# EasyEDA Pro project ProDoc_USB-C Advanced Power Supply.epro

# Schematic Schematic
Board Name: USB-C Advanced Power Supply; Create Date: 2026-04-28; Page Name: USB-C Advanced Power Supply; Project Name: USB-C Advanced Power Supply; Schematic Name: Schematic; Update Date: 2026-04-30; Company: FEDEVEL; Drawn: Robert Feranec; Page Size: A3; Version: V1I0
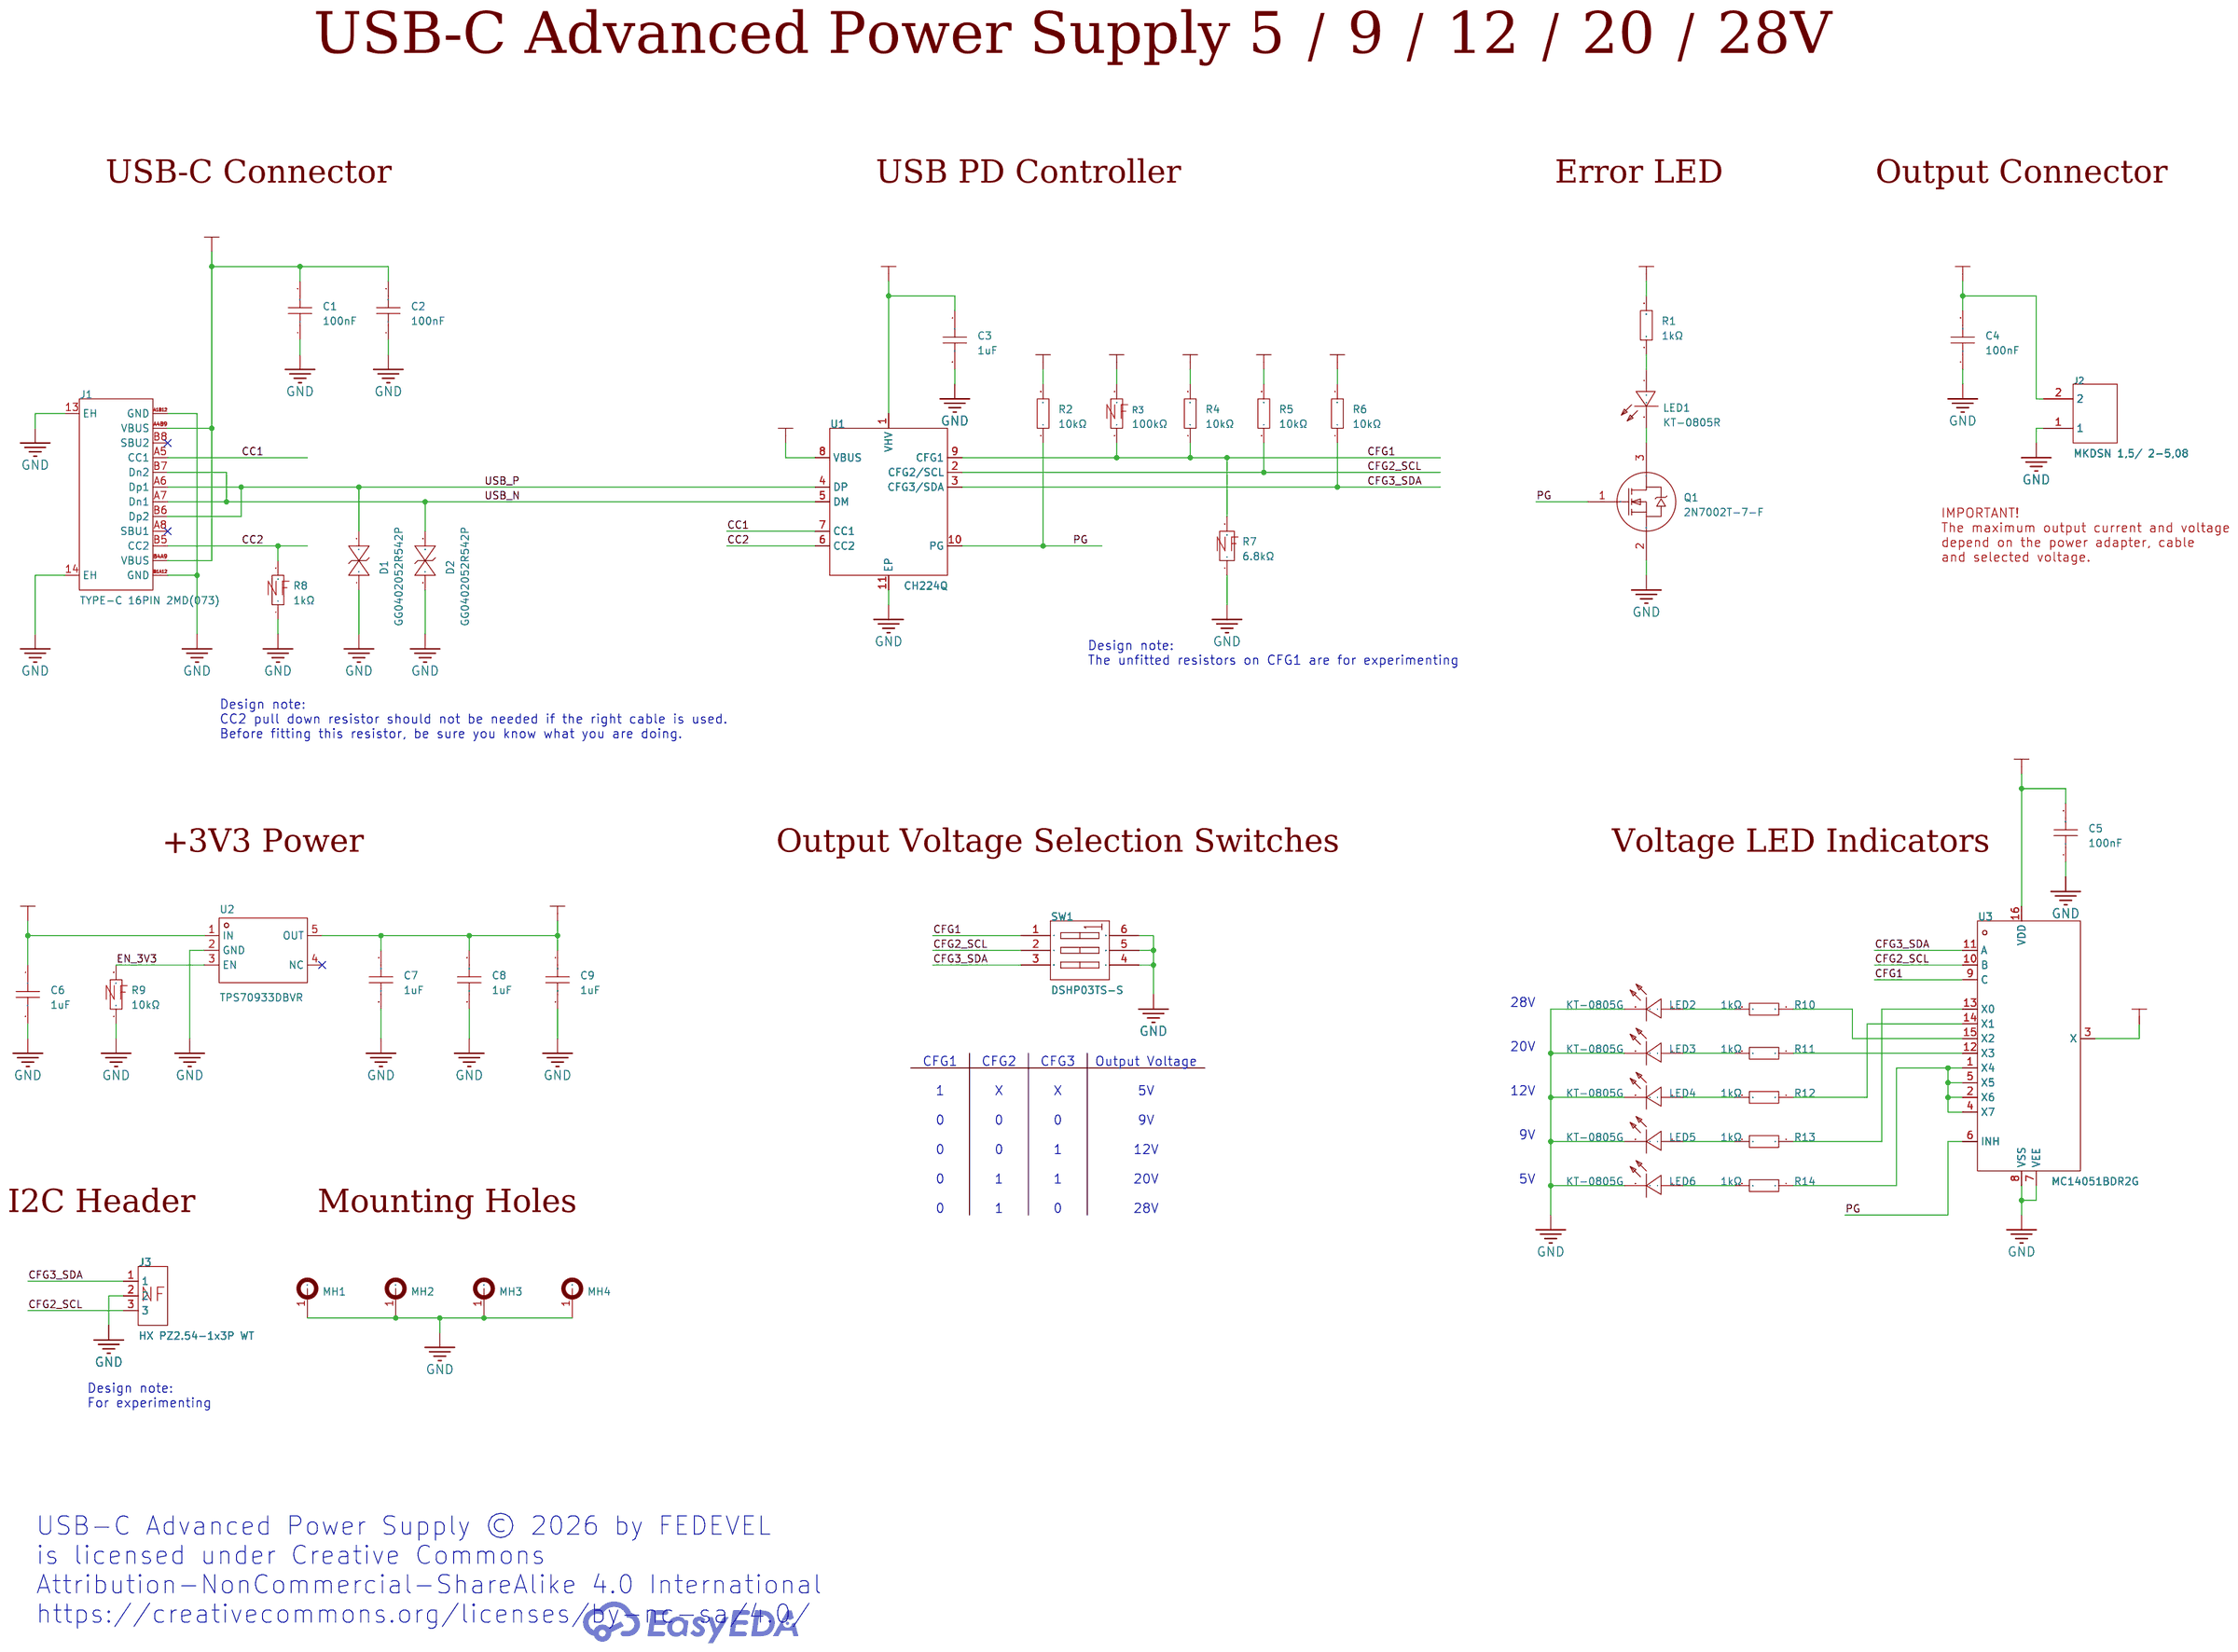
[diagram p0: schematic sheet]

## Parts
C1  100nF  [C0402]
C2  100nF  [C0402]
C3  1uF  [C0603]
C4  100nF  [C0402]
C5  100nF  [C0402]
C6  1uF  [C0603]
C7  1uF  [C0603]
C8  1uF  [C0603]
C9  1uF  [C0603]
D1  GG0402052R542P  [D0402-BI]
D2  GG0402052R542P  [D0402-BI]
J1  TYPE-C 16PIN 2MD(073)  [USB-C-SMD_TYPE-C-16PIN-2MD-073]
J2  MKDSN 1,5/ 2-5,08  [CONN-TH_2P-P5.08_1729128]
J3  HX PZ2.54-1x3P WT  [HDR-SMD_3P-P2.54-H-M_KH-2.54PH-1X3P-L13.5-WT]  (no BOM)
LED1  KT-0805R  [LED0805-R-RD]
LED2  KT-0805G  [LED0805-R-RD]
LED3  KT-0805G  [LED0805-R-RD]
LED4  KT-0805G  [LED0805-R-RD]
LED5  KT-0805G  [LED0805-R-RD]
LED6  KT-0805G  [LED0805-R-RD]
MH1  -  [MH_7.5MMx2.7MM]  (no BOM)
MH2  -  [MH_7.5MMx2.7MM]  (no BOM)
MH3  -  [MH_7.5MMx2.7MM]  (no BOM)
MH4  -  [MH_7.5MMx2.7MM]  (no BOM)
Q1  2N7002T-7-F  [SOT-523-3_L1.6-W0.8-P1.00-LS1.6-BR]
R1  1kΩ  [R0402]
R2  10kΩ  [R0402]
R3  100kΩ  [R0402]  (no BOM)
R4  10kΩ  [R0402]
R5  10kΩ  [R0402]
R6  10kΩ  [R0402]
R7  6.8kΩ  [R0402]  (no BOM)
R8  1kΩ  [R0402]  (no BOM)
R9  10kΩ  [R0402]  (no BOM)
R10  1kΩ  [R0402]
R11  1kΩ  [R0402]
R12  1kΩ  [R0402]
R13  1kΩ  [R0402]
R14  1kΩ  [R0402]
SW1  DSHP03TS-S  [SW-SMD_DSHP03TS-S]
U1  CH224Q  [DFN-10_L2.0-W2.0-P0.40-BL-EP]
U2  TPS70933DBVR  [SOT-23-5_L3.0-W1.7-P0.95-LS2.8-BR]
U3  MC14051BDR2G  [SOIC-16_L9.9-W3.9-P1.27-LS6.0-BL_1]

## Library data of the parts
C1 C2 C4 C5 = CL05B104KB54PNC: Capacitance:100nF Tolerance:±10% Tolerance:±10% Voltage Rating:50V Temperature Coefficient:X7R; LCSC Part Name: 100nF ±10% 50V; Supplier Part: C307331; Manufacturer: SAMSUNG(三星); Supplier Footprint: 0402; JLCPCB Part Class: Basic Part; Datasheet: https://item.szlcsc.com/datasheet/CL05B104KB54PNC/291005.html; Supplier: LCSC; Tolerance: ±10%; Voltage Rating: 50V; Temperature Coefficient: X7R
C3 C6-C9 = CL10B105KB8NQNC: Capacitance:1uF Tolerance:±10% Tolerance:±10% Voltage Rating:50V Temperature Coefficient:X7R; LCSC Part Name: 1uF ±10% 50V; Supplier Part: C5199872; Manufacturer: SAMSUNG(三星); Supplier Footprint: 0603; JLCPCB Part Class: Extended Part; Datasheet: https://item.szlcsc.com/datasheet/CL10B105KB8NQNC/5885909.html; Supplier: LCSC; Tolerance: ±10%; Voltage Rating: 50V; Temperature Coefficient: X7R
D1 D2 = GG0402052R542P: Reverse Stand-Off Voltage (Vrwm):5V Clamping Voltage:15.5V Peak Pulse Current (Ipp):3A@8/20us Peak Pulse Power Dissipation (Ppp):46W@8/20us Voltage - Breakdown:5.5V Reverse Leakage Current (Ir):100nA Operating Temperature:-55℃~+125℃ Operating Temperature:; LCSC Part Name: ESD 5V截止 峰值脉冲电流：3A@8/20us; Supplier Part: C1973257; Manufacturer: Kyocera AVX; Supplier Footprint: 0402; JLCPCB Part Class: Extended Part; Supplier: LCSC; Reverse Stand-Off Voltage (Vrwm): 5V; Clamping Voltage: 15.5V; Peak Pulse Current (Ipp): 3A@8/20us; Peak Pulse Power Dissipation (Ppp): 46W@8/20us; Voltage - Breakdown: 5.5V; Reverse Leakage Current (Ir): 100nA; Operating Temperature: -55℃~+125℃; level of protection: IEC 61000-4-4；IEC 61000-4-2; Type: ESD; Junction Capacitance: 2.5pF
J1 = TYPE-C 16PIN 2MD(073): Connector Type:Type-C Protocol Standard:- Gender:Female Mounting Type:Surface Mount, Right Angle Number of Contacts:16P Number of Ports:1 Current Rating-Power:3A Voltage Rating:5V Connect-Disconnect Life:10,000 Cycles Supplementary Features:- Center Heigh; LCSC Part Name: Type-C 母 卧贴; Supplier Part: C2765186; Manufacturer: SHOU HAN(首韩); Supplier Footprint: SMD; JLCPCB Part Class: Extended Part; Datasheet: https://item.szlcsc.com/datasheet/TYPE-C%252016PIN%25202MD(073)/2901843.html; Supplier: LCSC; Connector Type: Type-C; Gender: Female; Mounting Type: Surface Mount, Right Angle; Number of Contacts: 16P; Number of Ports: 1; Current Rating-Power: 3A; Voltage Rating: 5V; Connect-Disconnect Life: 10,000 Cycles; Detection color: Black; Operating Temperature: -25℃~+85℃
J2 = MKDSN 1,5/ 2-5,08: Connector Type:Board Side/Plug Number of Positions or Pins:1x2P Pitch:5.08mm Color:Green Mounting Type:Through Hole Number of Pins:2P Number of Rows:1 Number of PINs Per Row:2 Current Rating:13.5A Voltage Rating (Max):400V; LCSC Part Name: 1x2P 5.08mm 排数:1 每排P数:2; Supplier Part: C5183989; Manufacturer: Phoenix Contact(菲尼克斯); Supplier Footprint: 插件,P=5.08mm; JLCPCB Part Class: Extended Part; Datasheet: https://item.szlcsc.com/datasheet/MKDSN%25201%252C5%252F%25202-5%252C08/5848939.html; Supplier: LCSC; Connector Type: Board Side/Plug; Number of Positions or Pins: 1x2P; Pitch: 5.08mm; Color: Green; Mounting Type: Through Hole; Number of Pins: 2P; Number of Rows: 1; Number of PINs Per Row: 2; Current Rating: 13.5A; Voltage Rating (Max): 400V
J3 = HX PZ2.54-1x3P WT: Pin Structure:1x3P Pitch:2.54mm Row Spacing:- Circluar Pins/Square Pins:Pin Header Mounting Type:Surface Mount, Right Angle Number of Rows:1 Number of Pins:3P Current Rating:3A Voltage Rating (Max):1kV Length of Mating Pin:6mm Insulation Height:2.5mm Leng; LCSC Part Name: 配套排母：HX PM2.54-1x3P系列 1x3P 间距:2.54mm 方针 卧贴; Supplier Part: C46061676; Manufacturer: hanxia(韩下); Supplier Footprint: SMD,P=2.54mm,卧贴; JLCPCB Part Class: Extended Part; Datasheet: https://item.szlcsc.com/datasheet/HX%2520PZ2.54-1x3P%2520WT/48170536.html; Supplier: LCSC; Pin Structure: 1x3P; Pitch: 2.54mm; Circluar Pins/Square Pins: Pin Header; Mounting Type: Surface Mount, Right Angle; Number of Rows: 1; Number of Pins: 3P; Current Rating: 3A; Voltage Rating (Max): 1kV; Length of Mating Pin: 6mm; Insulation Height: 2.5mm; Contact Material: Brass; Contact Plating: Gold; Operating Temperature: -40℃~+105℃; Color: Black
LED1 = KT-0805R: LCSC Part Name: 0805 红灯 高亮; Supplier Part: C2295; Manufacturer: KENTO; Supplier Footprint: 0805; JLCPCB Part Class: Extended Part; Supplier: LCSC
LED2-LED6 = KT-0805G: Lamp Holder Type:- Illumination Color:Emerald Green Voltage - Forward(Vf):2.6V~3.1V Voltage - Forward(Vf):2.6V~3.1V Power(Watts):100mW Forward Current:5mA Wavelength - Dominant:513nm~528nm Wavelength - Dominant:513nm~528nm Peak Wavelength:525nm Diode Conf; LCSC Part Name: 0805 翠绿 高亮; Supplier Part: C2297; Manufacturer: KENTO; Supplier Footprint: 0805; JLCPCB Part Class: Basic Part; Datasheet: https://item.szlcsc.com/datasheet/KT-0805G/2670.html; Supplier: LCSC; Illumination Color: Emerald Green; Voltage - Forward(Vf): 2.6V~3.1V; Power(Watts): 100mW; Forward Current: 5mA; Wavelength - Dominant: 513nm~528nm; Peak Wavelength: 525nm; Diode Configuration: Discrete Diode; Lens Color: Water Clear; Luminous Intensity: 430mcd; Viewing Angle: 120°; Operating Temperature: -40℃~+85℃
MH1-MH4 = MH_7.5MMx2.7MM
Q1 = 2N7002T-7-F: Number:1 N-Channel Drain to Source Voltage:60V Current - Continuous Drain(Id):115mA RDS(on):13.5Ω@10V,0.5A Pd - Power Dissipation:150mW Gate Threshold Voltage (Vgs(th)):2V@250uA Gate Charge(Qg):- Input Capacitance(Ciss):50pF Reverse Transfer Capacitance (; LCSC Part Name: 1个N沟道 耐压:60V 电流:115mA; Supplier Part: C139445; Manufacturer: DIODES(美台); Supplier Footprint: SOT-523; JLCPCB Part Class: Extended Part; Datasheet: https://item.szlcsc.com/datasheet/2N7002T-7-F/150768.html; Supplier: LCSC; Number: 1 N-Channel; Drain to Source Voltage: 60V; Current - Continuous Drain(Id): 115mA; RDS(on): 13.5Ω@10V,0.5A; Pd - Power Dissipation: 150mW; Gate Threshold Voltage (Vgs(th)): 2V@250uA; Input Capacitance(Ciss): 50pF; Reverse Transfer Capacitance (Crss@Vds): 5pF; Operating Temperature: -55℃~+150℃; Output Capacitance(Coss): 25pF
R1 R8 R10-R14 = 0402WGF1001TCE: Type:Thick Film Resistor Resistance:1kΩ Tolerance:±1% Tolerance:±1% Power(Watts):62.5mW Voltage-Supply(Max):50V Temperature Coefficient:±100ppm/℃ Temperature Coefficient:±100ppm/℃ Operating Temperature:-55℃~+155℃ Operating Temperature:-55℃~+155℃; LCSC Part Name: 1kΩ ±1% 62.5mW 厚膜电阻; Supplier Part: C11702; Manufacturer: UNI-ROYAL(厚声); Supplier Footprint: 0402; JLCPCB Part Class: Basic Part; Datasheet: https://item.szlcsc.com/datasheet/0402WGF1001TCE/12256.html; Supplier: LCSC; Type: Thick Film Resistor; Tolerance: ±1%; Power(Watts): 62.5mW; Voltage-Supply(Max): 50V; Temperature Coefficient: ±100ppm/℃; Operating Temperature: -55℃~+155℃
R2 R4-R6 R9 = 0402WGF1002TCE: Type:Thick Film Resistor Resistance:10kΩ Tolerance:±1% Tolerance:±1% Power(Watts):62.5mW Voltage-Supply(Max):50V Temperature Coefficient:±100ppm/℃ Temperature Coefficient:±100ppm/℃ Operating Temperature:-55℃~+155℃ Operating Temperature:-55℃~+155℃; LCSC Part Name: 10kΩ ±1% 62.5mW 厚膜电阻; Supplier Part: C25744; Manufacturer: UNI-ROYAL(厚声); Supplier Footprint: 0402; JLCPCB Part Class: Basic Part; Datasheet: https://item.szlcsc.com/datasheet/0402WGF1002TCE/26487.html; Supplier: LCSC; Type: Thick Film Resistor; Tolerance: ±1%; Power(Watts): 62.5mW; Voltage-Supply(Max): 50V; Temperature Coefficient: ±100ppm/℃; Operating Temperature: -55℃~+155℃
R3 = 0402WGF1003TCE: Type:Thick Film Resistor Resistance:100kΩ Tolerance:±1% Tolerance:±1% Power(Watts):62.5mW Voltage-Supply(Max):50V Temperature Coefficient:±100ppm/℃ Temperature Coefficient:±100ppm/℃ Operating Temperature:-55℃~+155℃ Operating Temperature:-55℃~+155℃; LCSC Part Name: 100kΩ ±1% 62.5mW 厚膜电阻; Supplier Part: C25741; Manufacturer: UNI-ROYAL(厚声); Supplier Footprint: 0402; JLCPCB Part Class: Basic Part; Datasheet: https://item.szlcsc.com/datasheet/0402WGF1003TCE/26484.html; Supplier: LCSC; Type: Thick Film Resistor; Tolerance: ±1%; Power(Watts): 62.5mW; Voltage-Supply(Max): 50V; Temperature Coefficient: ±100ppm/℃; Operating Temperature: -55℃~+155℃
R7 = NQ02WGF6801TCE: Type:Thick Film Resistor Resistance:6.8kΩ Tolerance:±1% Tolerance:±1% Power(Watts):62.5mW Voltage-Supply(Max):100V Temperature Coefficient:±100ppm/℃ Temperature Coefficient:±100ppm/℃ Operating Temperature:-55℃~+155℃ Operating Temperature:-55℃~+155℃; LCSC Part Name: 厚膜电阻 6.8kΩ ±1% 62.5mW 抗硫化汽车级晶片电阻器; Supplier Part: C965237; Manufacturer: UNI-ROYAL(厚声); Supplier Footprint: 0402; JLCPCB Part Class: Extended Part; Datasheet: https://item.szlcsc.com/datasheet/NQ02WGF6801TCE/1050369.html; Supplier: LCSC; Type: Thick Film Resistor; Tolerance: ±1%; Power(Watts): 62.5mW; Voltage-Supply(Max): 100V; Temperature Coefficient: ±100ppm/℃; Operating Temperature: -55℃~+155℃
SW1 = DSHP03TS-S: Type:Slide, Recessed Circuit:SPST Number of Positions:3 Termination Style:Gull Wing Lead Pitch:1.27mm Current Rating:25mA Voltage Rating:24V Operating Temperature:-20℃~+70℃ Operating Temperature:-20℃~+70℃ Operating Life:3,000 Cycles Color:Black; LCSC Part Name: 间距1.27mm 平拨,凹槽式 3位拨码开关; Supplier Part: C319051; Manufacturer: XKB Connection(中国星坤); Supplier Footprint: SMD-6P,5.4x5.4mm; JLCPCB Part Class: Extended Part; Datasheet: https://item.szlcsc.com/datasheet/DSHP03TS-S/300143.html; Supplier: LCSC; Type: Slide, Recessed; Circuit: SPST; Number of Positions: 3; Termination Style: Gull Wing; Lead Pitch: 1.27mm; Current Rating: 25mA; Voltage Rating: 24V; Operating Temperature: -20℃~+70℃; Operating Life: 3,000 Cycles; Color: Black
U1 = CH224Q-RF: Type:Power Receiver Controller Protocol:PD 3.2；SPR；PPS；AVS；BC 1.2 Number of Channels:1C Output Power:140W Output Voltage:5V；20V；15V；12V；28V；9V Voltage - Supply:4V~30V Voltage - Supply:4V~30V Operating Temperature:-40℃~+105℃ Operating Temperature:-40℃~+105; LCSC Part Name: USBPD多快充协议受电芯片; Supplier Part: C46061833; Manufacturer: WCH(南京沁恒); Supplier Footprint: DFN-10-EP(2x2); Datasheet: https://item.szlcsc.com/datasheet/CH224Q/48170822.html; Supplier: LCSC; Type: Power Receiver Controller; Protocol: PD 3.2；SPR；PPS；AVS；BC 1.2; Number of Channels: 1C; Output Power: 140W; Output Voltage: 5V；20V；15V；12V；28V；9V; Voltage - Supply: 4V~30V; Operating Temperature: -40℃~+105℃
U2 = TPS70933DBVR: Output Type:Fixed Voltage - Supply:30V Output Voltage:3.3V Output Voltage:3.3V Output Current:150mA Power Supply Rejection Ratio (PSRR):80dB@(10Hz) Voltage Dropout:960mV@(150mA) standby current:1.4uA Noise:190uVrms Features:Under Voltage Lockout；Over Curr; LCSC Part Name: 具有反向电流保护和使能功能的 150mA、30V、超低 IQ、低压降稳压器; Supplier Part: C89347; Manufacturer: TI(德州仪器); Supplier Footprint: SOT-23-5; JLCPCB Part Class: Extended Part; Datasheet: https://www.ti.com/cn/lit/gpn/tps709; Supplier: LCSC; Output Type: Fixed; Voltage - Supply: 30V; Output Voltage: 3.3V; Output Current: 150mA; Power Supply Rejection Ratio (PSRR): 80dB@(10Hz); Voltage Dropout: 960mV@(150mA); standby current: 1.4uA; Noise: 190uVrms; Features: Under Voltage Lockout；Over Current Protection；Enable；Over Temperature Protection; Operating Temperature: -40℃~+125℃@(Tj); Output Configuration: Positive; Number of Outputs: 1
U3 = MC14051BDR2G-RF: Switch Circuit:SP8T single pole eight throw Number of Channels:8 Supply Voltage:3V~18V Supply Voltage:3V~18V On-State Resistance (Max):1200Ω Operating Temperature:-55℃~+125℃ Operating Temperature:-55℃~+125℃; LCSC Part Name: MC14051B 8通道模拟多路复用器/多路分路器; Supplier Part: C7284; Manufacturer: onsemi(安森美); Supplier Footprint: SOIC-16; Datasheet: https://atta.szlcsc.com/upload/public/pdf/source/20191223/C463178_08A95CAC7B1F563D85784D081BFDA614.pdf; Supplier: LCSC; Switch Circuit: SP8T single pole eight throw; Number of Channels: 8; Supply Voltage: 3V~18V; On-State Resistance (Max): 1200Ω; Operating Temperature: -55℃~+125℃

## Nets
+3V3: C5.2 C7.1 C8.1 C9.1 R1.2 R2.2 R4.2 R5.2 R6.2 U2.5(OUT) U3.3(X) U3.16(VDD)
GND: C1.1 C2.1 C3.2 C4.1 C5.1 C6.2 C7.2 C8.2 C9.2 D1.1 D2.1 J1.13(EH) J1.14(EH) J1.A1B12(GND) J1.B1A12(GND) J2.1 J3.2 LED2.2(K) LED3.2(K) LED4.2(K) LED5.2(K) LED6.2(K) MH1.1 MH2.1 MH3.1 MH4.1 Q1.2(S) R7.1 R8.1 R9.1 SW1.4 SW1.5 SW1.6 U1.11(EP) U2.2(GND) U3.7(VEE) U3.8(VSS)
+V_USB: C1.2 C2.2 C3.1 C4.2 C6.1 J1.A4B9(VBUS) J1.B4A9(VBUS) J2.2 R3.2 U1.1(VHV) U1.8(VBUS) U2.1(IN)
CC1: J1.A5(CC1) U1.7(CC1)
CC2: J1.B5(CC2) R8.2 U1.6(CC2)
CFG1: R3.1 R4.1 R7.2 SW1.1 U1.9(CFG1) U3.9(C)
CFG2_SCL: J3.3 R5.1 SW1.2 U1.2(CFG2/SCL) U3.10(B)
CFG3_SDA: J3.1 R6.1 SW1.3 U1.3(CFG3/SDA) U3.11(A)
EN_3V3: R9.2 U2.3(EN)
PG: Q1.1(G) R2.1 U1.10(PG) U3.6(INH)
USB_N: D2.2 J1.A7(Dn1) J1.B7(Dn2) U1.5(DM)
USB_P: D1.2 J1.A6(Dp1) J1.B6(Dp2) U1.4(DP)
$1N2677: LED1.1(A) R1.1
$1N2754: LED1.2(K) Q1.3(D)
$1N3526: LED2.1(A) R10.2
$1N3530: LED3.1(A) R11.2
$1N3535: LED4.1(A) R12.2
$1N3540: LED5.1(A) R13.2
$1N3545: LED6.1(A) R14.2
$1N4003: R10.1 U3.15(X2)
$1N4009: R11.1 U3.12(X3)
$1N4014: R12.1 U3.14(X1)
$1N4021: R13.1 U3.13(X0)
$1N4028: R14.1 U3.1(X4) U3.2(X6) U3.4(X7) U3.5(X5)

Not connected (* = marked no-connect by the designer): J1 A8(SBU1)* B8(SBU2)*; U2 4(NC)*

## Notes on the sheet
- USB-C Advanced Power Supply 5 / 9 / 12 / 20 / 28V
- USB-C Connector
- USB PD Controller
- Error LED
- Output Connector
- NF
- IMPORTANT!
  The maximum output current and voltage
  depend on the power adapter, cable
  and selected voltage.
- NF
- NF
- Design note:
  The unfitted resistors on CFG1 are for experimenting
- Design note:
  CC2 pull down resistor should not be needed if the right cable is used.
  Before fitting this resistor, be sure you know what you are doing.
- +3V3 Power
- Output Voltage Selection Switches
- Voltage LED Indicators
- NF
- 28V
- 20V
- CFG1
- CFG2
- CFG3
- Output Voltage
- 1
- X
- X
- 5V
- 12V
- 0
- 0
- 0
- 9V
- 9V
- 0
- 0
- 1
- 12V
- 0
- 1
- 1
- 20V
- 5V
- I2C Header
- Mounting Holes
- 0
- 1
- 0
- 28V
- NF
- Design note:
  For experimenting
- USB-C Advanced Power Supply © 2026 by FEDEVEL
  is licensed under Creative Commons
  Attribution-NonCommercial-ShareAlike 4.0 International
  https://creativecommons.org/licenses/by-nc-sa/4.0/

# Board PCB
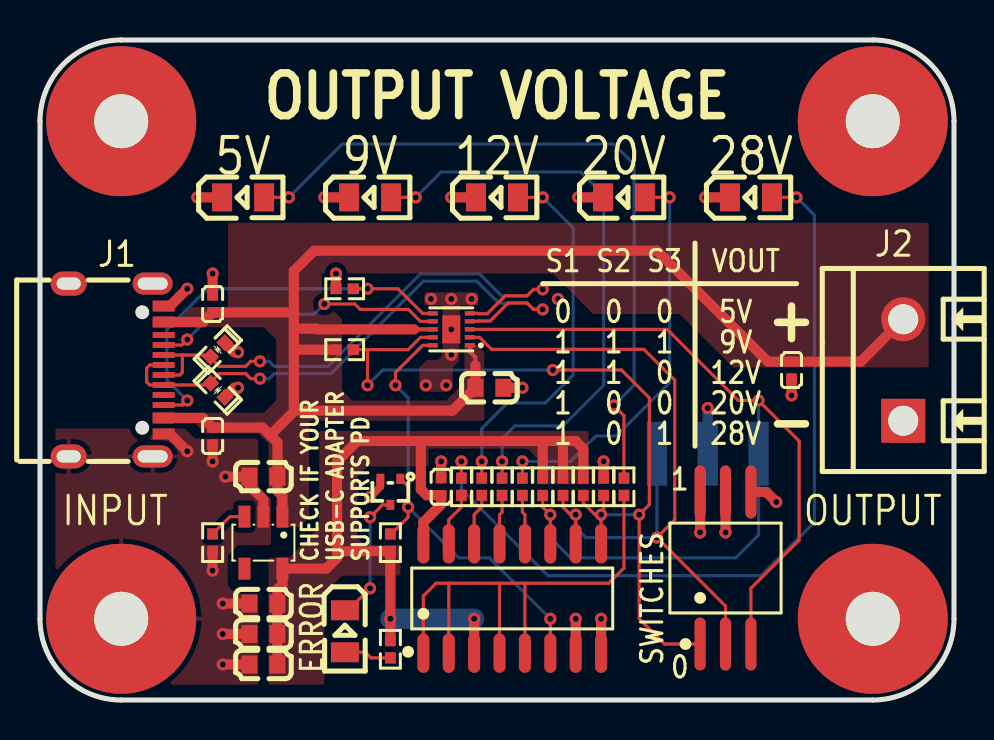
[diagram p1: board, top side]
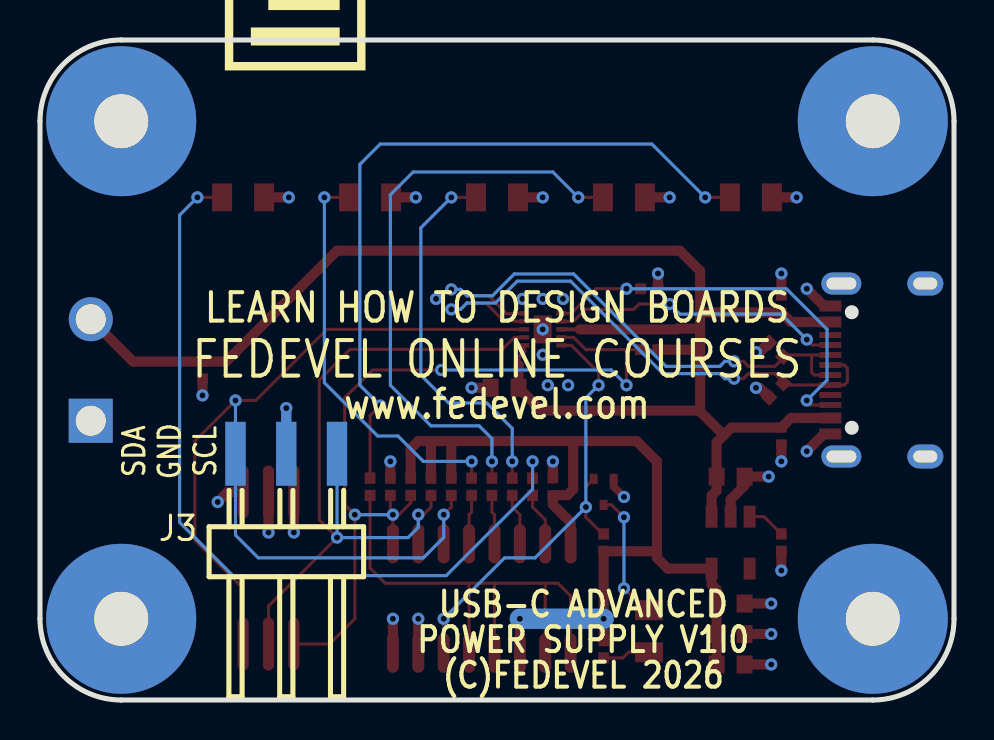
[diagram p2: board, bottom side, seen from below]

Outline 45.72 x 33.02 mm; copper layers: Top Layer, Inner1, Inner2, Bottom Layer. Coordinates in mm from the lower left corner of the outline.
Outline path: 0,28.96 0,4.06 arc(1.19,1.19) 4.06,0 41.66,0 arc(44.53,1.19) 45.72,4.06 45.72,28.96 arc(44.53,31.83) 41.66,33.02 4.06,33.02 arc(1.19,31.83) 0,28.96
Stack: Top Layer 0.035mm Outer layer thickness 1oz / Dielectric1 0.2104mm 7628 RC49% 8.6mil / Inner1 0.0152mm Inner layer thickness / Dielectric2 1.065mm 1.1mm H/HOZ Copper / Inner2 0.0152mm Inner layer thickness / Dielectric3 0.2104mm 7628 RC49% 8.6mil / Bottom Layer 0.035mm Outer layer thickness 1oz

## Design rules (mm)
net USB_P: DP1
net USB_N: DP1
template: User Custom Config
spacing copperThickness1oz (default): track to track 0.152, other pairs 0.152 to 0.305
spacing copperThickness2oz: track to track 0.203, other pairs 0.152 to 0.3
spacing USBC_Clearance: track to track 0.152, other pairs 0.152 to 0.3
track width copperThickness1oz (default): min 0.152, default 0.254, max 2.54
track width copperThickness2oz: min 0.203, default 0.254, max 2.54
differential pair differentialPair (default): width min 0.157, default 0.157, max 2.54; gap min 0.203, default 0.203
via viaSize (default): diameter min 0.5, default 0.61, max 10; hole min 0.3, default 0.305, max 6.3
net +V_USB uses copperRegionDirect
region e588 uses USBC_Clearance

## Placement (name value [footprint] x y rotation side)
C1  100nF  [C0402]  8.64 19.81 270 top
C2  100nF  [C0402]  8.64 13.21 90 top
C3  1uF  [C0603]  22.48 15.62 0 top
C4  100nF  [C0402]  37.59 16.51 90 top
C5  100nF  [C0402]  20.07 10.67 270 top
C6  1uF  [C0603]  11.18 11.18 180 top
C7  1uF  [C0603]  11.18 4.83 180 top
C8  1uF  [C0603]  11.18 3.3 180 top
C9  1uF  [C0603]  11.18 1.78 180 top
D1  GG0402052R542P  [D0402-BI]  8.89 15.49 135 top
D2  GG0402052R542P  [D0402-BI]  8.89 17.53 225 top
J1  TYPE-C 16PIN 2MD(073)  [USB-C-SMD_TYPE-C-16PIN-2MD-073]  3.81 16.51 270 top
J2  MKDSN 1,5/ 2-5,08  [CONN-TH_2P-P5.08_1729128]  43.18 16.51 90 top
J3  HX PZ2.54-1x3P WT  [HDR-SMD_3P-P2.54-H-M_KH-2.54PH-1X3P-L13.5-WT]  33.4 12.32 180 bottom
LED1  KT-0805R  [LED0805-R-RD]  15.25 3.44 270 top
LED2  KT-0805G  [LED0805-R-RD]  35.56 25.15 0 top
LED3  KT-0805G  [LED0805-R-RD]  29.21 25.15 0 top
LED4  KT-0805G  [LED0805-R-RD]  22.86 25.15 0 top
LED5  KT-0805G  [LED0805-R-RD]  16.51 25.15 0 top
LED6  KT-0805G  [LED0805-R-RD]  10.16 25.15 0 top
MH1  -  [MH_7.5MMx2.7MM]  4.06 4.06 0 top
MH2  -  [MH_7.5MMx2.7MM]  41.66 4.06 0 top
MH3  -  [MH_7.5MMx2.7MM]  41.66 28.96 0 top
MH4  -  [MH_7.5MMx2.7MM]  4.06 28.96 0 top
Q1  2N7002T-7-F  [SOT-523-3_L1.6-W0.8-P1.00-LS1.6-BR]  17.53 10.41 90 top
R1  1kΩ  [R0402]  17.53 2.54 90 top
R2  10kΩ  [R0402]  17.53 7.87 270 top
R3  100kΩ  [R0402]  15.24 17.53 180 top
R4  10kΩ  [R0402]  27.18 10.67 90 top
R5  10kΩ  [R0402]  26.16 10.67 90 top
R6  10kΩ  [R0402]  25.15 10.67 90 top
R7  6.8kΩ  [R0402]  28.19 10.67 270 top
R8  1kΩ  [R0402]  15.24 20.57 0 top
R9  10kΩ  [R0402]  8.64 7.87 90 top
R10  1kΩ  [R0402]  21.08 10.67 90 top
R11  1kΩ  [R0402]  24.13 10.67 90 top
R12  1kΩ  [R0402]  22.1 10.67 90 top
R13  1kΩ  [R0402]  23.11 10.67 90 top
R14  1kΩ  [R0402]  29.21 10.67 90 top
SW1  DSHP03TS-S  [SW-SMD_DSHP03TS-S]  34.29 6.6 0 top
U1  CH224Q  [DFN-10_L2.0-W2.0-P0.40-BL-EP]  20.57 18.54 90 top
U2  TPS70933DBVR  [SOT-23-5_L3.0-W1.7-P0.95-LS2.8-BR]  11.18 7.87 90 top
U3  MC14051BDR2G  [SOIC-16_L9.9-W3.9-P1.27-LS6.0-BL_1]  23.62 5.08 0 top

## Footprints (pads in the part's own frame, mm; a bottom-side part is the same pattern mirrored in y, then rotated)
C0402
  rect 0.5x0.54 smd: 1(-0.42,0) 2(0.42,0)
C0603
  rect 0.8x0.9 smd: 1(-0.7,0) 2(0.7,0)
CONN-TH_2P-P5.08_1729128
  rect 2.2x2.2 hole 1.5: 1(-2.54,0)
  round 2.2 hole 1.5: 2(2.54,0)
D0402-BI
  rect 0.6x0.6 smd: 1(-0.5,0) 2(0.5,0)
DFN-10_L2.0-W2.0-P0.40-BL-EP
  rect 0.224x0.505 smd: 1(-0.8,-0.927) 2(-0.4,-0.927) 3(0,-0.927) 4(0.4,-0.927) 5(0.8,-0.927) 6(0.8,0.927) 7(0.4,0.927) 8(0,0.927) 9(-0.4,0.927) 10(-0.8,0.927)
  rect 1.4x0.9 smd: 11(0,0)
HDR-SMD_3P-P2.54-H-M_KH-2.54PH-1X3P-L13.5-WT
  rect 1.02x3.2 smd: 1(-2.54,0) 2(0,0) 3(2.54,0)
LED0805-R-RD
  rect 1x1.399 smd: 1(1.05,0) 2(-1.05,0)
MH_7.5MMx2.7MM
  round 7.5 hole 2.7: 1(0,0)
R0402
  rect 0.566x0.54 smd: 1(-0.433,0) 2(0.433,0)
SOIC-16_L9.9-W3.9-P1.27-LS6.0-BL_1
  oval 0.602x1.971 smd: 1(-4.445,-2.736) 2(-3.175,-2.736) 3(-1.905,-2.736) 4(-0.635,-2.736) 5(0.635,-2.736) 6(1.905,-2.736) 7(3.175,-2.736) 8(4.445,-2.736) 9(4.445,2.736) 10(3.175,2.736) 11(1.905,2.736) 12(0.635,2.736) 13(-0.635,2.736) 14(-1.905,2.736) 15(-3.175,2.736) 16(-4.445,2.736)
SOT-23-5_L3.0-W1.7-P0.95-LS2.8-BR
  rect 1.1x0.6 smd: 1(1.3,-0.95) 2(1.3,0) 3(1.3,0.95) 4(-1.3,0.95) 5(-1.3,-0.95)
SOT-523-3_L1.6-W0.8-P1.00-LS1.6-BR
  rect 0.51x0.4 smd: 1(0.65,-0.5) 2(0.65,0.5) 3(-0.65,0)
SW-SMD_DSHP03TS-S
  oval 0.56x2.655 smd: 1(-1.27,-3.803) 2(0,-3.803) 3(1.27,-3.803) 4(1.27,3.803) 5(0,3.803) 6(-1.27,3.803)
USB-C-SMD_TYPE-C-16PIN-2MD-073
  oval 1.1x2 hole 0.6x1.5: 13(-4.325,1.825) 14(4.325,1.825)
  oval 1.2x1.8 hole 0.6x1.2: 13(-4.325,-2.375) 14(4.325,-2.375)
  rect 0.55x1.1 smd: A1B12(-3.2,2.375) A4B9(-2.4,2.375) B1A12(3.2,2.375) B4A9(2.4,2.375)
  rect 0.3x1.1 smd: A5(-1.25,2.375) A6(-0.25,2.375) A7(0.25,2.375) A8(1.25,2.375) B5(1.75,2.375) B6(0.75,2.375) B7(-0.75,2.375) B8(-1.75,2.375)

## Nets
As in the schematic.

Pads without a net: J1 A8 B8; U2 4

## Via types
v1: diameter 0.61, hole 0.305, Top Layer to Bottom Layer, 69 vias

## Routing (per net, layer and track width the routed paths; a pad name or vN(x,y) marks a point on that pad's centre or on a via; arc(x,y) is an arc through that point)
+3V3: length 50.2
  Top Layer w0.508: 26.17,12.95 25.13,12.95 ; 26.17,12.95 26.8,12.95 27.18,12.57 27.18,11.1 ; 26.17,12.95 26.16,12.94 26.16,11.1 ; 25.13,12.95 25.15,12.94 25.15,11.1 ; 25.13,12.95 19.12,12.95 ; 14.86,7.44 14.86,7.11 14.32,6.57 U2.5 12.13,5.78 11.88,5.53 C7.1 C8.1 C9.1 ; 14.86,7.44 14.86,11.94 15.88,12.95 19.12,12.95 ; 14.86,7.44 R2.2 v1(17.53,4.06) 17.53,2.97 ; U3.3 v1(21.72,4.06) ; 19.12,12.95 19.05,12.88 19.05,10.54 19.34,10.25 C5.2 20.07,9.78 19.18,8.89 19.18,7.82
  Bottom Layer w1.016: v1(21.72,4.06) v1(17.53,4.06)
GND: length 38
  Top Layer w0.381: Q1.2 17.03,10.68 v1(16.51,10.16)
  Top Layer w0.508: LED3.2 v1(26.92,25.15) ; C4.1 v1(37.59,15.24) ; J1.A1B12 6.5,19.71 v1(7.37,20.57) ; J1.B1A12 6.5,13.31 v1(7.37,12.45) ; SW1.5 v1(34.29,8.38) ; D1.1 9.72,15.62 v1(9.91,15.62) ; C8.2 v1(9.14,3.3) ; v1(36.83,9.91) 36.33,10.41 SW1.4 ; C7.2 v1(9.14,4.83) ; 28.19,11.1 v1(28.19,11.94) ; D2.1 9.72,17.4 v1(9.91,17.4) ; C5.1 v1(20.07,11.94) ; SW1.6 v1(33.02,8.38) ; C9.2 v1(9.14,1.78) ; LED4.2 v1(20.57,25.15) ; C2.1 v1(8.64,11.94) ; LED6.2 v1(7.87,25.15) ; R8.1 v1(14.81,21.34) ; LED5.2 v1(14.22,25.15) ; C3.2 v1(24.13,15.62) ; U2.2 11.18,10.03 10.48,10.73 C6.2 v1(9.27,11.18) ; C1.1 v1(8.64,21.34) ; 26.8,2.34 v1(26.8,4.06) ; U3.8 v1(28.07,4.06) ; R9.1 v1(8.64,6.48) ; LED2.2 v1(33.27,25.15)
  Bottom Layer w0.508: J3.2 v1(33.4,14.61)
  vias: v1(19.3,15.75) v1(19.56,20.07) v1(20.32,15.75) v1(20.57,20.07) v1(20.57,18.54) v1(20.57,17.27) v1(21.59,20.07) v1(25.91,20.07)
+V_USB: length 80.4
  Top Layer w0.203: U1.8 18.72,18.54 ; U1.1 21.5,17.42 21.78,17.14 21.78,16.75
  Top Layer w0.508: 18.72,18.54 13.88,18.54 13.84,18.58 12.7,18.58 ; 12.7,17.56 12.73,17.53 R3.2 ; 12.7,17.56 12.7,14.43 ; 12.7,17.56 12.7,18.58 ; 12.7,14.43 11.52,13.25 ; 12.7,14.43 12.75,14.48 20.64,14.48 C3.1 21.78,16.75 ; 12.7,18.58 12.7,19.39 ; J1.B4A9 8.15,14.11 C2.2 11.14,13.63 11.52,13.25 ; J2.2 41.06,16.93 C4.2 36.41,16.93 30.86,22.48 13.72,22.48 12.7,21.46 12.7,19.39 ; 11.52,13.25 11.88,12.89 C6.1 11.88,10.48 12.13,10.23 U2.1 ; 12.7,19.39 C1.2 8.15,18.91 J1.A4B9
CC1: length 14.7
  Top Layer w0.155: J1.A5 7.09,17.76 v1(7.37,18.03) ; v1(14.22,19.81) 15.75,19.81 16.02,19.54 18.43,19.54 19.03,18.94 U1.7
  Bottom Layer w0.155: v1(14.22,19.81) 13.72,19.3 8.64,19.3 v1(7.37,18.03)
CC2: length 20.6
  Top Layer w0.155: v1(7.37,14.99) 7.14,14.76 J1.B5 ; U1.6 19.14,19.34 17.91,20.57 v1(16.38,20.57) R8.2
  Bottom Layer w0.155: v1(7.37,14.99) 6.35,16 6.35,18.54 8.38,20.57 v1(16.38,20.57)
CFG1: length 41.7
  Top Layer w0.155: 16.39,17.53 16.38,17.52 v1(16.38,15.75) ; 16.39,17.53 18.41,17.53 19.03,18.14 U1.9 ; 16.39,17.53 R3.1 ; v1(25.65,16.51) 29.08,16.51 30.48,15.11 30.48,9.78 v1(29.97,9.27) 29.97,4.06 31.23,2.8 SW1.1 ; v1(28.07,9.27) 27.77,9.27 27.18,9.86 R4.1 ; v1(28.07,9.27) 28.19,9.4 R7.2 ; v1(28.07,9.27) U3.9
  Bottom Layer w0.155: v1(25.65,16.51) 17.15,16.51 v1(16.38,15.75) ; v1(28.07,9.27) v1(29.97,9.27)
CFG2_SCL: length 38.1
  Top Layer w0.155: 26.8,7.82 v1(26.8,9.27) 26.54,9.27 26.16,9.65 R5.1 ; SW1.2 34.29,4.7 v1(30.86,8.13) 31.75,9.02 31.75,16 30.21,17.54 22.59,17.54 21.99,18.14 U1.2
  Bottom Layer w0.155: 30.86,12.32 v1(30.86,8.13) 27.31,8.13 26.8,8.64 v1(26.8,9.27)
CFG3_SDA: length 51.7
  Top Layer w0.155: U1.3 31.37,18.54 34.93,14.99 v1(35.94,14.99) 37.97,12.95 37.97,8 35.56,5.59 SW1.3 ; R6.1 25.15,9.65 v1(25.53,9.27) U3.11
  Bottom Layer w0.155: v1(25.53,9.27) 25.53,8.13 26.54,7.11 34.8,7.11 35.94,8.25 J3.1 v1(35.94,14.99)
EN_3V3: length 1.9
  Top Layer w0.155: R9.2 9.5,9.17 U2.3
PG: length 23.8
  Top Layer w0.155: U1.10 19.14,17.74 17.78,16.38 ; Q1.1 18.41,10.67 v1(18.41,9.65) 18.41,9.14 17.58,8.31 R2.1 ; 17.78,16.34 v1(17.78,15.75) ; U3.6 v1(25.53,4.06)
  Bottom Layer w0.155: v1(25.53,4.06) 22.48,7.11 20.96,7.11 v1(18.41,9.65) 18.41,15.11 v1(17.78,15.75)
USB_N: length 28
  Top Layer w0.158: U1.5 21.91,19.34 21.93,19.32 22.37,19.32 23.27,20.22 24.36,20.22 24.68,20.54 v1(25.15,20.54) ; 7.12,17.26 8.45,17.26 D2.2 8.54,17.12 8.96,16.69 10.29,16.69 10.54,16.94 v1(11,16.94) ; 7.12,17.26 J1.B7 ; 7.12,17.26 7.12,16.39 6.99,16.26 J1.A7
  Bottom Layer w0.158: v1(25.15,20.54) 24.68,20.54 24.36,20.22 23.09,20.22 21.99,21.32 19.03,21.32 14.4,16.69 11.72,16.69 11.46,16.94 v1(11,16.94)
USB_P: length 28.6
  Top Layer w0.158: v1(11,16.08) 10.54,16.08 10.29,16.33 8.96,16.33 8.54,15.9 D1.2 8.45,15.76 J1.B6 5.49,15.76 5.33,15.92 5.33,16.6 5.49,16.76 J1.A6 ; v1(25.15,19.54) 24.68,19.54 24.36,19.86 23.42,19.86 22.52,18.96 21.93,18.96 21.91,18.94 U1.4
  Bottom Layer w0.158: v1(25.15,19.54) 24.68,19.54 24.36,19.86 22.94,19.86 21.84,20.95 19.18,20.95 14.55,16.33 11.72,16.33 11.46,16.08 v1(11,16.08)
$1N2677: length 2.4
  Top Layer w0.155: LED1.1 16.28,2.39 16.56,2.11 R1.1
$1N2754: length 6.5
  Top Layer w0.155: 15.25,4.49 15.41,4.49 v1(16.51,5.59) ; v1(16.51,9.14) 17.13,9.76 Q1.3
  Bottom Layer w0.155: v1(16.51,9.14) v1(16.51,5.59)
$1N3526: length 40.6
  Top Layer w0.155: 21.08,11.1 v1(21.08,11.94) ; LED2.1 v1(37.85,25.15)
  Bottom Layer w0.155: v1(21.08,11.94) 21.08,10.54 25.4,6.22 36.07,6.22 38.74,8.89 38.74,24.26 v1(37.85,25.15)
$1N3530: length 20.3
  Top Layer w0.155: 24.13,11.1 v1(24.13,11.94) ; LED3.1 v1(31.5,25.15)
  Bottom Layer w0.155: v1(24.13,11.94) 26.54,11.94 27.81,13.21 28.83,13.21 31.5,15.88 v1(31.5,25.15)
$1N3535: length 18.9
  Top Layer w0.155: 22.1,11.1 v1(22.1,11.94) ; LED4.1 v1(25.15,25.15)
  Bottom Layer w0.155: v1(22.1,11.94) 22.1,13.59 23.37,14.86 25.27,14.86 26.67,16.26 26.67,23.62 v1(25.15,25.15)
$1N3540: length 29.3
  Top Layer w0.155: 23.11,11.1 v1(23.11,11.94) ; LED5.1 v1(18.8,25.15)
  Bottom Layer w0.155: v1(18.8,25.15) 20.07,26.42 27.05,26.42 28.19,25.27 28.19,15.75 26.16,13.72 23.75,13.72 23.11,13.08 v1(23.11,11.94)
$1N3545: length 36.4
  Top Layer w0.155: v1(28.7,14.73) 29.21,14.22 29.21,11.1 ; LED6.1 v1(12.45,25.15)
  Bottom Layer w0.155: v1(28.7,14.73) 29.72,15.75 29.72,26.8 28.7,27.81 15.11,27.81 v1(12.45,25.15)
$1N4003: length 2.7
  Top Layer w0.155: U3.15 20.45,9.02 21.08,9.65 R10.1
$1N4009: length 2.5
  Top Layer w0.155: U3.12 24.26,9.27 24.13,9.4 R11.1
$1N4014: length 2.6
  Top Layer w0.155: U3.14 21.72,9.27 22.1,9.65 R12.1
$1N4021: length 2.5
  Top Layer w0.155: U3.13 22.99,9.27 23.11,9.4 R13.1
$1N4028: length 27.6
  Top Layer w0.155: U3.2 20.45,5.84 20.45,5.84 ; 24.29,5.84 28.45,5.84 29.21,6.6 R14.1 ; 24.29,5.84 23,5.84 ; 24.29,5.84 24.26,5.81 U3.5 ; 20.45,5.84 19.81,5.84 19.18,5.21 19.18,2.34 ; 20.45,5.84 23,5.84 ; 23,5.84 22.99,5.83 U3.4

## Copper pours and planes (outline as drawn; the poured copper is in the pictures)
+3V3 on Top Layer: 11.43,0.76 11.43,7.11 12.45,7.11 13.97,8.64 13.97,13.46 27.43,13.46 27.43,10.8 24.89,10.8 24.89,12.06 24.38,12.57 19.43,12.57 19.43,11.68 16.38,11.68 15.88,11.18 15.88,8.13 16.26,7.75 18.03,7.75 18.03,6.22 15.11,6.22 14.22,5.33 14.22,0.76
GND on Top Layer: 19.23,20.4 21.92,20.4 21.92,19.74 21.03,19.74 21.03,17.02 20.65,16.64 20.65,15.57 20.5,15.42 19.15,15.42 18.97,15.6 18.97,16.64 19.35,17.02 19.91,17.02 20.12,17.22 20.12,19.74 19.23,19.74
GND on Top Layer: 10.92,0.76 10.92,5.33 9.78,5.33 9.4,5.72 9.4,7.24 9.91,7.75 11.56,7.75 11.56,10.03 10.92,10.67 10.92,12.95 10.79,13.08 7.75,13.08 7.24,13.59 0.76,13.59 0.76,0.76
GND on Inner1: 0.26,32.76 45.46,32.76 45.46,0.26 0.26,0.26
GND on Inner2: 0.26,32.76 45.46,32.76 45.46,0.26 0.26,0.26
+V_USB on Top Layer: 5.61,13.84 5.61,14.38 11.2,14.38 11.81,14.99 11.81,18.03 11.2,18.64 5.64,18.64 5.64,19.18 7.11,19.18 7.59,19.66 9.4,19.66 9.4,23.88 44.45,23.88 44.45,16.64 34.67,16.64 32,19.3 27.69,19.3 25.65,21.34 14.1,21.34 14.1,20.07 15.11,19.05 15.11,15.49 15.62,14.99 20.32,14.99 21.23,15.9 21.23,17.86 21.77,17.86 22.22,17.4 22.22,13.97 13.46,13.97 13.46,9.14 12.95,8.64 11.81,8.64 11.81,10.16 11.43,10.54 11.43,12.83 10.92,13.33 8.25,13.33 7.75,13.84

Small or netless copper shapes (teardrops, artwork), in the pictures only: 24 on Inner1, 24 on Inner2

## Text on the board
Bottom Silkscreen Layer: SCL | GND | SDA | USB-C ADVANCED | POWER SUPPLY V1I0 | (C)FEDEVEL 2026 | LEARN HOW TO DESIGN BOARDS | www.fedevel.com | FEDEVEL ONLINE COURSES
Document Layer: USB-C Advanced Power Supply © 2026 by FEDEVEL / is licensed under Creative Commons / Attribution-NonCommercial-ShareAlike 4.0 International / https://creativecommons.org/licenses/by-nc-sa/4.0/
Top Silkscreen Layer: CHECK IF YOUR | USB-C ADAPTER | SUPPORTS PD | ERROR | SWITCHES | S1 | 0 | 1 | S2 | S3 | 5V | 9V | 12V | 20V | 28V | VOUT | INPUT | OUTPUT | OUTPUT VOLTAGE | + | -
